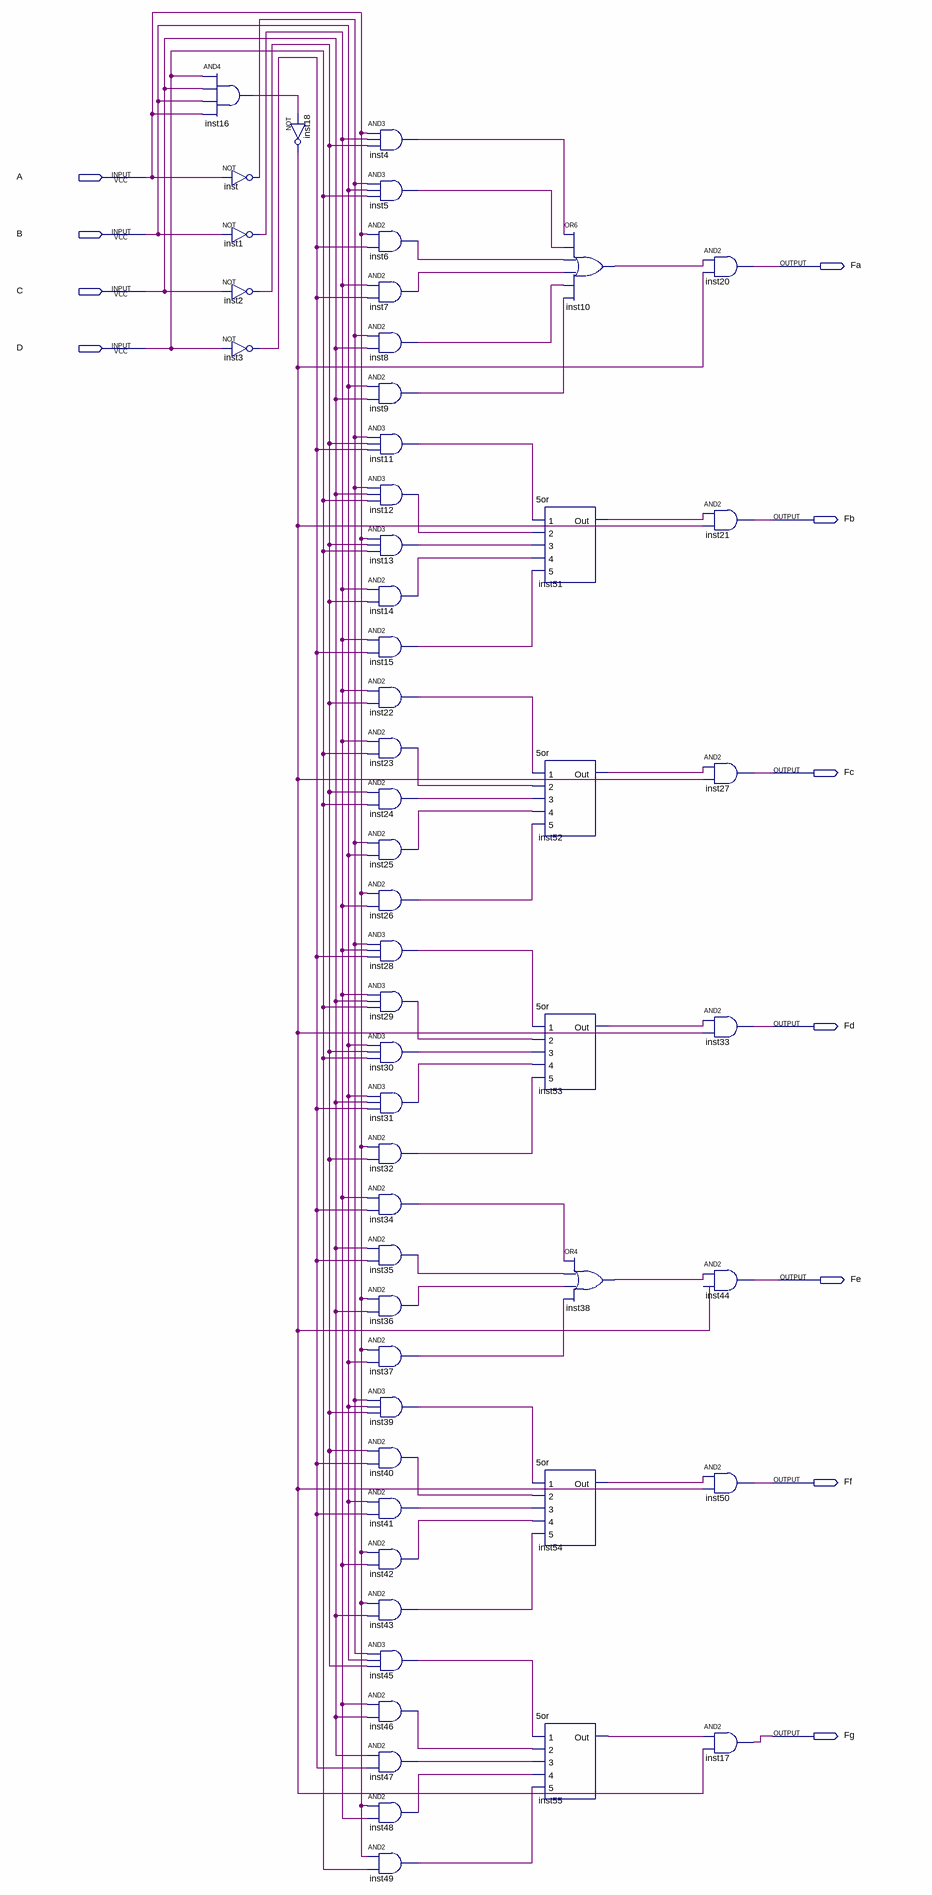
[diagram p0: schematic sheet]
// Quartus schematic Decodificador7Seg.bdf as structural Verilog: 55 symbols, 11 pins
module Decodificador7Seg (
  input  A,
  input  B,
  input  C,
  input  D,
  output Fa,
  output Fb,
  output Fc,
  output Fd,
  output Fe,
  output Ff,
  output Fg
);

  wire inst1_out, inst2_out, inst3_out, inst4_out, inst5_out, inst6_out, inst7_out, inst8_out, inst9_out,
       inst10_out, inst11_out, inst12_out, inst13_out, inst14_out, inst15_out, inst16_out, inst18_out,
       inst22_out, inst23_out, inst24_out, inst25_out, inst26_out, inst28_out, inst29_out, inst30_out,
       inst31_out, inst32_out, inst34_out, inst35_out, inst36_out, inst37_out, inst38_out, inst39_out,
       inst40_out, inst41_out, inst42_out, inst43_out, inst45_out, inst46_out, inst47_out, inst48_out,
       inst49_out, inst51_out, inst52_out, inst53_out, inst54_out, inst55_out, inst_out;

  and inst16 (inst16_out, D, C, B, A);
  not inst (inst_out, A);
  not inst1 (inst1_out, B);
  not inst2 (inst2_out, C);
  not inst3 (inst3_out, D);
  not inst18 (inst18_out, inst16_out);
  and inst4 (inst4_out, A, inst1_out, inst2_out);
  and inst5 (inst5_out, inst_out, B, D);
  and inst6 (inst6_out, A, inst3_out);
  and inst7 (inst7_out, inst1_out, inst3_out);
  and inst8 (inst8_out, inst_out, C);
  and inst9 (inst9_out, B, C);
  and inst11 (inst11_out, inst_out, inst2_out, inst3_out);
  and inst12 (inst12_out, inst_out, C, D);
  and inst13 (inst13_out, A, inst2_out, D);
  and inst14 (inst14_out, inst1_out, inst2_out);
  and inst15 (inst15_out, inst1_out, inst3_out);
  and inst22 (inst22_out, inst1_out, inst2_out);
  and inst23 (inst23_out, inst1_out, D);
  and inst24 (inst24_out, inst2_out, D);
  and inst25 (inst25_out, inst_out, B);
  and inst26 (inst26_out, A, inst1_out);
  and inst28 (inst28_out, inst_out, inst1_out, inst3_out);
  and inst29 (inst29_out, inst1_out, C, D);
  and inst30 (inst30_out, B, inst2_out, D);
  and inst31 (inst31_out, B, C, inst3_out);
  and inst32 (inst32_out, A, inst2_out);
  and inst34 (inst34_out, inst1_out, inst3_out);
  and inst35 (inst35_out, C, inst3_out);
  and inst36 (inst36_out, A, C);
  and inst37 (inst37_out, A, B);
  and inst39 (inst39_out, inst_out, B, inst2_out);
  and inst40 (inst40_out, inst2_out, inst3_out);
  and inst41 (inst41_out, B, inst3_out);
  and inst42 (inst42_out, A, inst1_out);
  and inst43 (inst43_out, A, C);
  and inst45 (inst45_out, inst_out, B, inst2_out);
  and inst46 (inst46_out, inst1_out, C);
  and inst47 (inst47_out, C, inst3_out);
  and inst48 (inst48_out, A, inst1_out);
  and inst49 (inst49_out, A, D);
  \5or  inst51 (
    .\1 (inst11_out), .\2 (inst12_out), .\3 (inst13_out), .\4 (inst14_out), .\5 (inst15_out), .Out(inst51_out));
  \5or  inst52 (
    .\1 (inst22_out), .\2 (inst23_out), .\3 (inst24_out), .\4 (inst25_out), .\5 (inst26_out), .Out(inst52_out));
  \5or  inst53 (
    .\1 (inst28_out), .\2 (inst29_out), .\3 (inst30_out), .\4 (inst31_out), .\5 (inst32_out), .Out(inst53_out));
  \5or  inst54 (
    .\1 (inst39_out), .\2 (inst40_out), .\3 (inst41_out), .\4 (inst42_out), .\5 (inst43_out), .Out(inst54_out));
  \5or  inst55 (
    .\1 (inst45_out), .\2 (inst46_out), .\3 (inst47_out), .\4 (inst48_out), .\5 (inst49_out), .Out(inst55_out));
  or inst10 (inst10_out, inst4_out, inst5_out, inst6_out, inst7_out, inst8_out, inst9_out);
  or inst38 (inst38_out, inst34_out, inst35_out, inst36_out, inst37_out);
  and inst20 (Fa, inst10_out, inst18_out);
  and inst21 (Fb, inst51_out, inst18_out);
  and inst27 (Fc, inst52_out, inst18_out);
  and inst33 (Fd, inst53_out, inst18_out);
  and inst44 (Fe, inst38_out, inst18_out);
  and inst50 (Ff, inst54_out, inst18_out);
  and inst17 (Fg, inst55_out, inst18_out);
endmodule
